# Altium schematic sheet LPGDetA1_mech.SchDoc
size A4; DocumentNumber: 6; SheetNumber: 6; SheetTotal: 6; Subtitle0: Elementy mechaniczne; LotOfPieces: 1; SVNPath: SVNPath
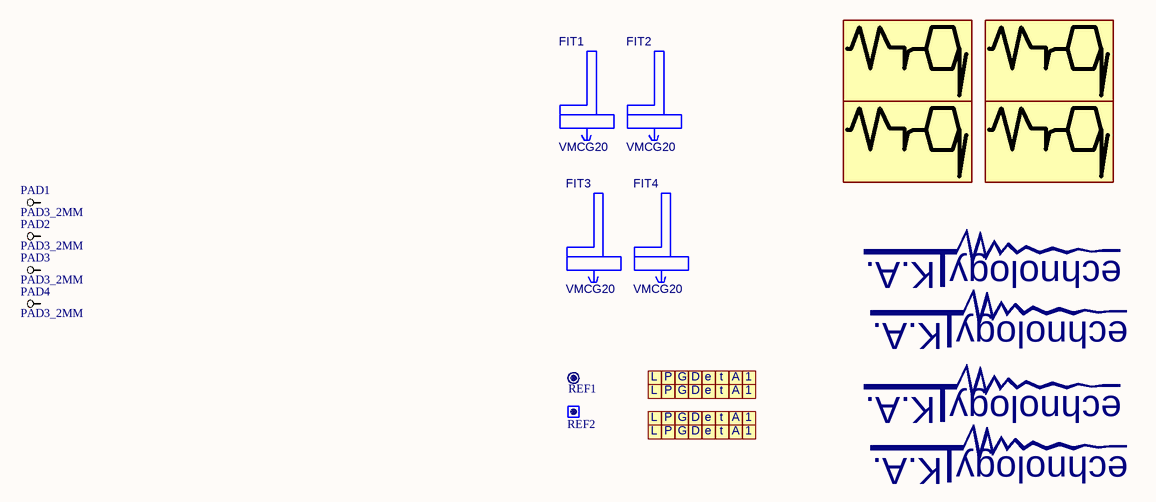
[diagram p0: LPGDetA1_mech.SchDoc]

## Parts
?  (no value)
FIT1  VMCG20  [VMCG20]
FIT2  VMCG20  [VMCG20]
FIT3  VMCG20  [VMCG20]
FIT4  VMCG20  [VMCG20]
LETTER1  LETTERC_L  [LETTERC_L_60_10_TL]  (value not drawn)  (no BOM)
LETTER2  LETTERC_P  [LETTERC_P_60_10_TL]  (value not drawn)  (no BOM)
LETTER3  LETTERC_G  [LETTERC_G_60_10_TL]  (value not drawn)  (no BOM)
LETTER4  LETTERC_D  [LETTERC_D_60_10_TL]  (value not drawn)  (no BOM)
LETTER5  LETTER_E  [LETTER_E_60_10_TL]  (value not drawn)  (no BOM)
LETTER6  LETTER_T  [LETTER_T_60_10_TL]  (value not drawn)  (no BOM)
LETTER7  LETTERC_A  [LETTERC_A_60_10_TL]  (value not drawn)  (no BOM)
LETTER8  LETTER_1  [LETTER_1_60_10_TL]  (value not drawn)  (no BOM)
LETTER9  LETTERC_L  [LETTERC_L_60_20_TS]  (value not drawn)  (no BOM)
LETTER10  LETTERC_P  [LETTERC_P_60_20_TS]  (value not drawn)  (no BOM)
LETTER11  LETTERC_G  [LETTERC_G_60_20_TS]  (value not drawn)  (no BOM)
LETTER12  LETTERC_D  [LETTERC_D_60_20_TS]  (value not drawn)  (no BOM)
LETTER13  LETTER_E  [LETTER_E_60_20_TS]  (value not drawn)  (no BOM)
LETTER14  LETTER_T  [LETTER_T_60_20_TS]  (value not drawn)  (no BOM)
LETTER15  LETTERC_A  [LETTERC_A_60_20_TS]  (value not drawn)  (no BOM)
LETTER16  LETTER_1  [LETTER_1_60_20_TS]  (value not drawn)  (no BOM)
LETTER17  LETTERC_L  [LETTERC_L_60_10_TL]  (value not drawn)  (no BOM)
LETTER18  LETTERC_P  [LETTERC_P_60_10_TL]  (value not drawn)  (no BOM)
LETTER19  LETTERC_G  [LETTERC_G_60_10_TL]  (value not drawn)  (no BOM)
LETTER20  LETTERC_D  [LETTERC_D_60_10_TL]  (value not drawn)  (no BOM)
LETTER21  LETTER_E  [LETTER_E_60_10_TL]  (value not drawn)  (no BOM)
LETTER22  LETTER_T  [LETTER_T_60_10_TL]  (value not drawn)  (no BOM)
LETTER23  LETTERC_A  [LETTERC_A_60_10_TL]  (value not drawn)  (no BOM)
LETTER24  LETTER_1  [LETTER_1_60_10_TL]  (value not drawn)  (no BOM)
LETTER25  LETTERC_L  [LETTERC_L_60_20_TS]  (value not drawn)  (no BOM)
LETTER26  LETTERC_P  [LETTERC_P_60_20_TS]  (value not drawn)  (no BOM)
LETTER27  LETTERC_G  [LETTERC_G_60_20_TS]  (value not drawn)  (no BOM)
LETTER28  LETTERC_D  [LETTERC_D_60_20_TS]  (value not drawn)  (no BOM)
LETTER29  LETTER_E  [LETTER_E_60_20_TS]  (value not drawn)  (no BOM)
LETTER30  LETTER_T  [LETTER_T_60_20_TS]  (value not drawn)  (no BOM)
LETTER31  LETTERC_A  [LETTERC_A_60_20_TS]  (value not drawn)  (no BOM)
LETTER32  LETTER_1  [LETTER_1_60_20_TS]  (value not drawn)  (no BOM)
LOGO1  MRQ_2_8  [MRQ_2_8_TL]  (value not drawn)  (no BOM)
LOGO2  MRQ_2_8  [MRQ_2_8_TL]  (value not drawn)  (no BOM)
LOGO3  MRQ_2_8  [MRQ_2_16_TS]  (value not drawn)  (no BOM)
LOGO4  MRQ_2_8  [MRQ_2_16_TS]  (value not drawn)  (no BOM)
LOGO5  KATECHNOLOGYLOGO  [KATECHNOLOGYLOGO_TL]  (value not drawn)  (no BOM)
LOGO6  KATECHNOLOGYLOGO  [KATECHNOLOGYLOGO_TS]  (value not drawn)  (no BOM)
LOGO7  KATECHNOLOGYLOGO  [KATECHNOLOGYLOGO_TL]  (value not drawn)  (no BOM)
LOGO8  KATECHNOLOGYLOGO  [KATECHNOLOGYLOGO_TS]  (value not drawn)  (no BOM)
PAD1  PAD3_2MM  [PAD3_2MM]  (no BOM)
PAD2  PAD3_2MM  [PAD3_2MM]  (no BOM)
PAD3  PAD3_2MM  [PAD3_2MM]  (no BOM)
PAD4  PAD3_2MM  [PAD3_2MM]  (no BOM)
REF1  REF_CIR  [REF_CIR]  (value not drawn)  (no BOM)
REF2  REF_REC  [REF_REC]  (value not drawn)  (no BOM)

## Nets

Not connected (* = marked no-connect by the designer): PAD1 1; PAD2 1; PAD3 1; PAD4 1

## Notes on the sheet
- K.A.
- echnology
- Wariant:
- Projekt i wykonanie: Miroslaw Lach MRQ, www.mrq-ml.com
- "AMPROJECT" Andrzej Maciejak
- SVNPath:
- Page:
- Rev.
- /
- File name:
- (in symbol KATechnologyLogo[[/\]]KATECHLOGO) K.A.; echnology
- (in symbol LETTER_1[[/\]]LETTER_1) 1
- (in symbol LETTER_E[[/\]]LETTER_E) e
- (in symbol LETTER_T[[/\]]LETTER_T) t
- (in symbol LETTERC_A[[/\]]LETTER_A) A
- (in symbol LETTERC_D[[/\]]LETTER_D) D
- (in symbol LETTERC_G[[/\]]LETTER_G) G
- (in symbol LETTERC_L[[/\]]LETTER_L) L
- (in symbol LETTERC_P[[/\]]LETTER_P) P

## Library data of the parts
? = KATECHNOLOGYLOGO
FIT1-FIT4 = VMCG20[[/\]]VMCG20: Reference5: Adsys; Typ5: Richco plastic; Currency5: 0,6800; Amount5: PLN; Value: VMCG20; Dimensions: VMCG20; Supplier5: wspornik plytki drukowanej; Manufacturer5: VMCG20; Price1: 41251
LETTER1 LETTER9 LETTER17 LETTER25 = LETTERC_L[[/\]]LETTER_L: Value: LETTERC_L; Dimensions: LETTER_L
LETTER2 LETTER10 LETTER18 LETTER26 = LETTERC_P[[/\]]LETTER_P: Value: LETTERC_P; Dimensions: LETTER_P
LETTER3 LETTER11 LETTER19 LETTER27 = LETTERC_G[[/\]]LETTER_G: Value: LETTERC_G; Dimensions: LETTER_G
LETTER4 LETTER12 LETTER20 LETTER28 = LETTERC_D[[/\]]LETTER_D: Value: LETTERC_D; Dimensions: LETTER_D
LETTER5 LETTER13 LETTER21 LETTER29 = LETTER_E[[/\]]LETTER_E: Value: LETTER_E; Dimensions: LETTER_E
LETTER6 LETTER14 LETTER22 LETTER30 = LETTER_T[[/\]]LETTER_T: Value: LETTER_T; Dimensions: LETTER_T
LETTER7 LETTER15 LETTER23 LETTER31 = LETTERC_A[[/\]]LETTER_A: Value: LETTERC_A; Dimensions: LETTER_A
LETTER8 LETTER16 LETTER24 LETTER32 = LETTER_1[[/\]]LETTER_1: Value: LETTER_1; Dimensions: LETTER_1
LOGO1-LOGO4 = MRQ_2_8[[/\]]MRQLOGO: Value: MRQ_2_8; Dimensions: MRQLOGO
LOGO5-LOGO8 = KATechnologyLogo[[/\]]KATECHLOGO: Value: KATechnologyLogo; Dimensions: KATECHLOGO
PAD1-PAD4 = PAD3_2MM[[/\]]PAD3_2MM: Value: PAD3_2MM; Dimensions: PAD3_2MM
REF1 = REF_CIR[[/\]]REF_CIR: Punkt referencyjny dla  płyty używany przez FLX2010; Descript: Reference point; Value: REF_CIR; Dimensions: REF_CIR
REF2 = REF_REC[[/\]]REF_REC: Punkt referencyjny dla  płyty używany przez FLX2010; Descript: Reference point; Value: REF_REC; Dimensions: REF_REC